# EAGLE schematic artPancreas (EAGLE 8.2.0)
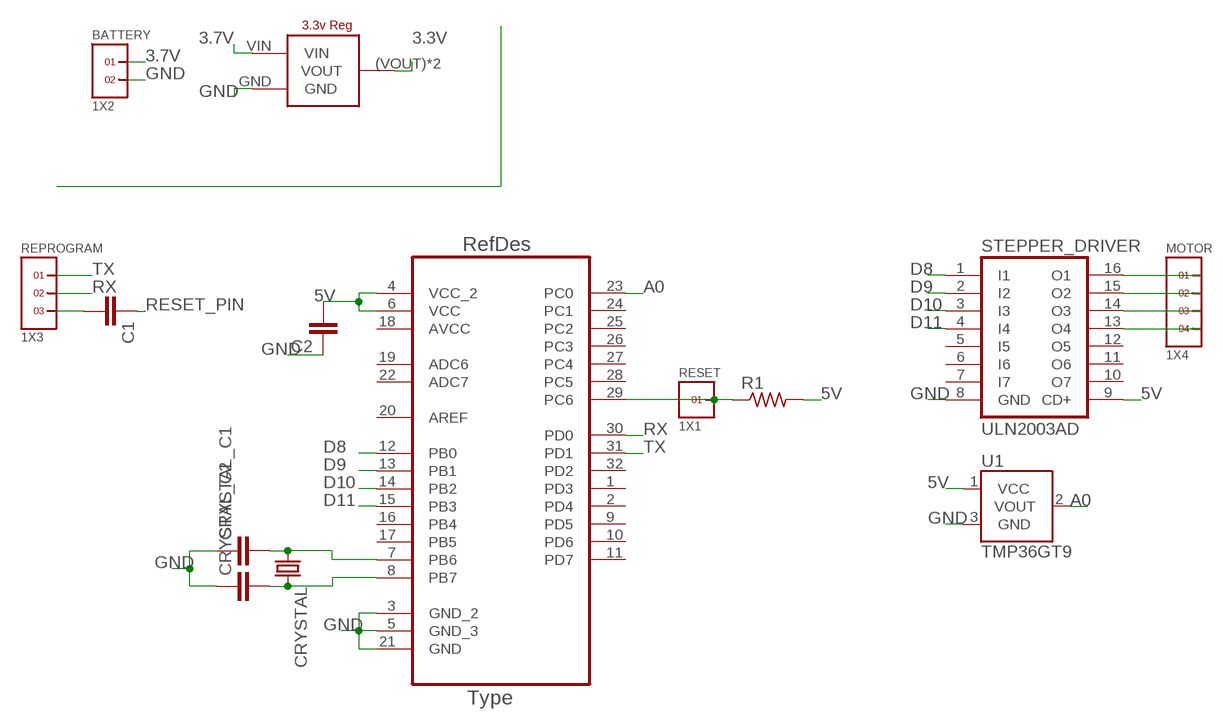
[diagram p0: schematic, sheet 1]

## Parts
ATMEGA328SMD  ATMEGA328P-AU  [QFP80P900X900X120-32N]
BATTERY  1X2  [1X2]
C1  C2,5-3  [C2.5-3]
C2  C2,5-3  [C2.5-3]
CRYSTAL  CRYSTALHC18U-V  [HC18U-V]
CRYSTAL_C1  C2,5-3  [C2.5-3]
CRYSTAL_C2  C2,5-3  [C2.5-3]
MOTOR  1X4  [1X4]
R1  R-US_0204/5  [0204/5]
REPROGRAM  1X3  [1X3]
RESET  1X1  [1X1]
STEPPER_DRIVER  ULN2003AD  [SO16]
U1  TMP36GT9  [TO-92]
U$1  LD1117  [LD1117SOT-223]

## Nets
3.3V: U$1.(VOUT)(VOUT) U$1.VOUT
3.7V: BATTERY.1 U$1.VIN
5V: ATMEGA328SMD.4(VCC_2) ATMEGA328SMD.6(VCC) C2.2 R1.2 STEPPER_DRIVER.9(CD+) U1.1(VCC)
A0: ATMEGA328SMD.23(PC0) U1.2(VOUT)
D8: ATMEGA328SMD.12(PB0) STEPPER_DRIVER.1(I1)
D9: ATMEGA328SMD.13(PB1) STEPPER_DRIVER.2(I2)
D10: ATMEGA328SMD.14(PB2) STEPPER_DRIVER.3(I3)
D11: ATMEGA328SMD.15(PB3) STEPPER_DRIVER.4(I4)
GND: ATMEGA328SMD.3(GND_2) ATMEGA328SMD.5(GND_3) ATMEGA328SMD.21(GND) BATTERY.2 C2.1 CRYSTAL_C1.1 CRYSTAL_C2.1 STEPPER_DRIVER.8(GND) U1.3(GND) U$1.GND
N$2: ATMEGA328SMD.7(PB6) CRYSTAL.1 CRYSTAL_C1.2
N$3: ATMEGA328SMD.8(PB7) CRYSTAL.2 CRYSTAL_C2.2
N$4: MOTOR.1 STEPPER_DRIVER.16(O1)
N$6: MOTOR.2 STEPPER_DRIVER.15(O2)
N$7: C1.2 REPROGRAM.3
N$8: MOTOR.3 STEPPER_DRIVER.14(O3)
N$9: MOTOR.4 STEPPER_DRIVER.13(O4)
RESET_PIN: ATMEGA328SMD.29(PC6) C1.1 R1.1 RESET.1
RX: ATMEGA328SMD.30(PD0) REPROGRAM.2
TX: ATMEGA328SMD.31(PD1) REPROGRAM.1
Unconnected: ATMEGA328SMD.1(PD3) ATMEGA328SMD.2(PD4) ATMEGA328SMD.9(PD5) ATMEGA328SMD.10(PD6) ATMEGA328SMD.11(PD7) ATMEGA328SMD.16(PB4) ATMEGA328SMD.17(PB5) ATMEGA328SMD.19(ADC6) ATMEGA328SMD.20(AREF) ATMEGA328SMD.22(ADC7) ATMEGA328SMD.24(PC1) ATMEGA328SMD.25(PC2) ATMEGA328SMD.26(PC3) ATMEGA328SMD.27(PC4) ATMEGA328SMD.28(PC5) ATMEGA328SMD.32(PD2) STEPPER_DRIVER.5(I5) STEPPER_DRIVER.6(I6) STEPPER_DRIVER.7(I7) STEPPER_DRIVER.10(O7) STEPPER_DRIVER.11(O6) STEPPER_DRIVER.12(O5)

## Power pins joined to a net without a drawn wire
AVCC: ATMEGA328SMD.18(AVCC)

## Library data of the parts
ATMEGA328SMD = atmega328pSMD:ATMEGA328P-AU; DESCRIPTION: 8-bit Microcontroller with In-System Programmable Flash; MPN: ATMEGA328P-AU; OC_FARNELL: 1715486; OC_NEWARK: 14R4631; PACKAGE: TQFP-32; SUPPLIER: Atmel
BATTERY = header pins:1X2
C1 C2 CRYSTAL_C1 CRYSTAL_C2 = capacitor-wima:C: CAPACITOR naming: grid - package width
CRYSTAL = adafruit:CRYSTAL: CRYSTAL; OC_FARNELL: unknown; OC_NEWARK: unknown
MOTOR = header pins:1X4
R1 = adafruit:R-US_: RESISTOR, American symbol
REPROGRAM = header pins:1X3
RESET = header pins:1X1
STEPPER_DRIVER = StepperMotorDriver:ULN2003A: DRIVER ARRAY
U1 = TMP36:TMP36: Precision degC temp sensor, analog out; AVAILABILITY: Unavailable; DESCRIPTION: DIP Low Voltage Temperature Sensor, 50uA, 2.7V-5.5V, −40°C to +125°C; MF: Analog Devices; MP: TMP36; PACKAGE: SOT-23-5 Analog Devices; PRICE: None
U$1 = LD1117:LD1117